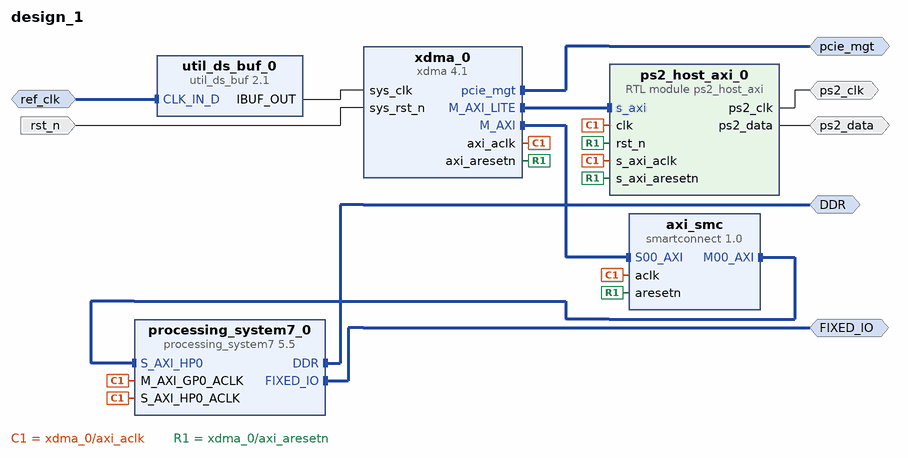
[diagram p0: block diagram of the top level]
# Vivado block design design_1, xc7z015clg485-2, Vivado 2018.3
create_bd_design design_1

create_bd_intf_port -mode Master -vlnv xilinx.com:interface:pcie_7x_mgt_rtl:1.0 pcie_mgt
create_bd_intf_port -mode Slave -vlnv xilinx.com:interface:diff_clock_rtl:1.0 ref_clk
set_property -dict {CONFIG.FREQ_HZ 100000000} [get_bd_intf_ports ref_clk]
create_bd_intf_port -mode Master -vlnv xilinx.com:interface:ddrx_rtl:1.0 DDR
create_bd_intf_port -mode Master -vlnv xilinx.com:display_processing_system7:fixedio_rtl:1.0 FIXED_IO
create_bd_port -dir I -type rst rst_n
set_property -dict {CONFIG.POLARITY ACTIVE_LOW} [get_bd_ports rst_n]
create_bd_port -dir IO ps2_clk
create_bd_port -dir IO ps2_data

create_bd_cell -type ip -vlnv xilinx.com:ip:xdma:4.1 xdma_0
set_property -dict [list \
  CONFIG.PF0_DEVICE_ID_mqdma 9021 \
  CONFIG.PF2_DEVICE_ID_mqdma 9021 \
  CONFIG.PF3_DEVICE_ID_mqdma 9021 \
  CONFIG.axilite_master_en true \
  CONFIG.mode_selection Basic \
  CONFIG.pf0_device_id 7021 \
  CONFIG.pl_link_cap_max_link_speed 5.0_GT/s \
  CONFIG.plltype QPLL1 \
] [get_bd_cells xdma_0]
create_bd_cell -type ip -vlnv xilinx.com:ip:processing_system7:5.5 processing_system7_0
set_property -dict [list \
  CONFIG.PCW_PRESET_BANK1_VOLTAGE {LVCMOS 1.8V} \
  CONFIG.PCW_QSPI_GRP_SINGLE_SS_ENABLE 1 \
  CONFIG.PCW_QSPI_GRP_SINGLE_SS_IO {MIO 1 .. 6} \
  CONFIG.PCW_QSPI_PERIPHERAL_ENABLE 1 \
  CONFIG.PCW_QSPI_QSPI_IO {MIO 1 .. 6} \
  CONFIG.PCW_SINGLE_QSPI_DATA_MODE x4 \
  CONFIG.PCW_UIPARAM_DDR_PARTNO {MT41K256M16 RE-125} \
  CONFIG.PCW_USE_S_AXI_HP0 1 \
] [get_bd_cells processing_system7_0]
# 50 more settings of processing_system7_0 are not shown: defaults, MIO pin electricals, DDR timing, and values the tool derives
create_bd_cell -type ip -vlnv xilinx.com:ip:util_ds_buf:2.1 util_ds_buf_0
set_property -dict {CONFIG.C_BUF_TYPE IBUFDSGTE} [get_bd_cells util_ds_buf_0]
create_bd_cell -type ip -vlnv xilinx.com:ip:smartconnect:1.0 axi_smc
set_property -dict {CONFIG.NUM_SI 1} [get_bd_cells axi_smc]
create_bd_cell -type module -reference ps2_host_axi ps2_host_axi_0

# ---- connections ----

connect_bd_intf_net [get_bd_intf_pins xdma_0/M_AXI_LITE] [get_bd_intf_pins ps2_host_axi_0/s_axi]
connect_bd_intf_net [get_bd_intf_pins axi_smc/M00_AXI] [get_bd_intf_pins processing_system7_0/S_AXI_HP0]
connect_bd_intf_net [get_bd_intf_ports pcie_mgt] [get_bd_intf_pins xdma_0/pcie_mgt]
connect_bd_intf_net -intf_net diff_clock_rtl_0_1 [get_bd_intf_ports ref_clk] [get_bd_intf_pins util_ds_buf_0/CLK_IN_D]
connect_bd_intf_net [get_bd_intf_pins xdma_0/M_AXI] [get_bd_intf_pins axi_smc/S00_AXI]
connect_bd_intf_net [get_bd_intf_ports DDR] [get_bd_intf_pins processing_system7_0/DDR]
connect_bd_intf_net [get_bd_intf_ports FIXED_IO] [get_bd_intf_pins processing_system7_0/FIXED_IO]
connect_bd_net [get_bd_pins util_ds_buf_0/IBUF_OUT] [get_bd_pins xdma_0/sys_clk]
connect_bd_net -net reset_rtl_0_1 [get_bd_ports rst_n] [get_bd_pins xdma_0/sys_rst_n]
connect_bd_net [get_bd_pins xdma_0/axi_aclk] \
  [get_bd_pins axi_smc/aclk] [get_bd_pins processing_system7_0/S_AXI_HP0_ACLK] \
  [get_bd_pins processing_system7_0/M_AXI_GP0_ACLK] [get_bd_pins ps2_host_axi_0/s_axi_aclk] [get_bd_pins ps2_host_axi_0/clk]
connect_bd_net [get_bd_pins xdma_0/axi_aresetn] \
  [get_bd_pins axi_smc/aresetn] [get_bd_pins ps2_host_axi_0/s_axi_aresetn] [get_bd_pins ps2_host_axi_0/rst_n]
connect_bd_net [get_bd_ports ps2_clk] [get_bd_pins ps2_host_axi_0/ps2_clk]
connect_bd_net [get_bd_ports ps2_data] [get_bd_pins ps2_host_axi_0/ps2_data]

# ---- address map ----
assign_bd_address -offset 0x0000000000000000 -range 1G -target_address_space [get_bd_addr_spaces xdma_0/M_AXI] [get_bd_addr_segs processing_system7_0/S_AXI_HP0/HP0_DDR_LOWOCM]
assign_bd_address -offset 0x44A00000 -range 4K -target_address_space [get_bd_addr_spaces xdma_0/M_AXI_LITE] [get_bd_addr_segs ps2_host_axi_0/s_axi/reg0]

validate_bd_design
save_bd_design
